# Altium schematic sheet Ripple_PMS.SchDoc
size C; SheetNumber: 1; SheetTotal: 1
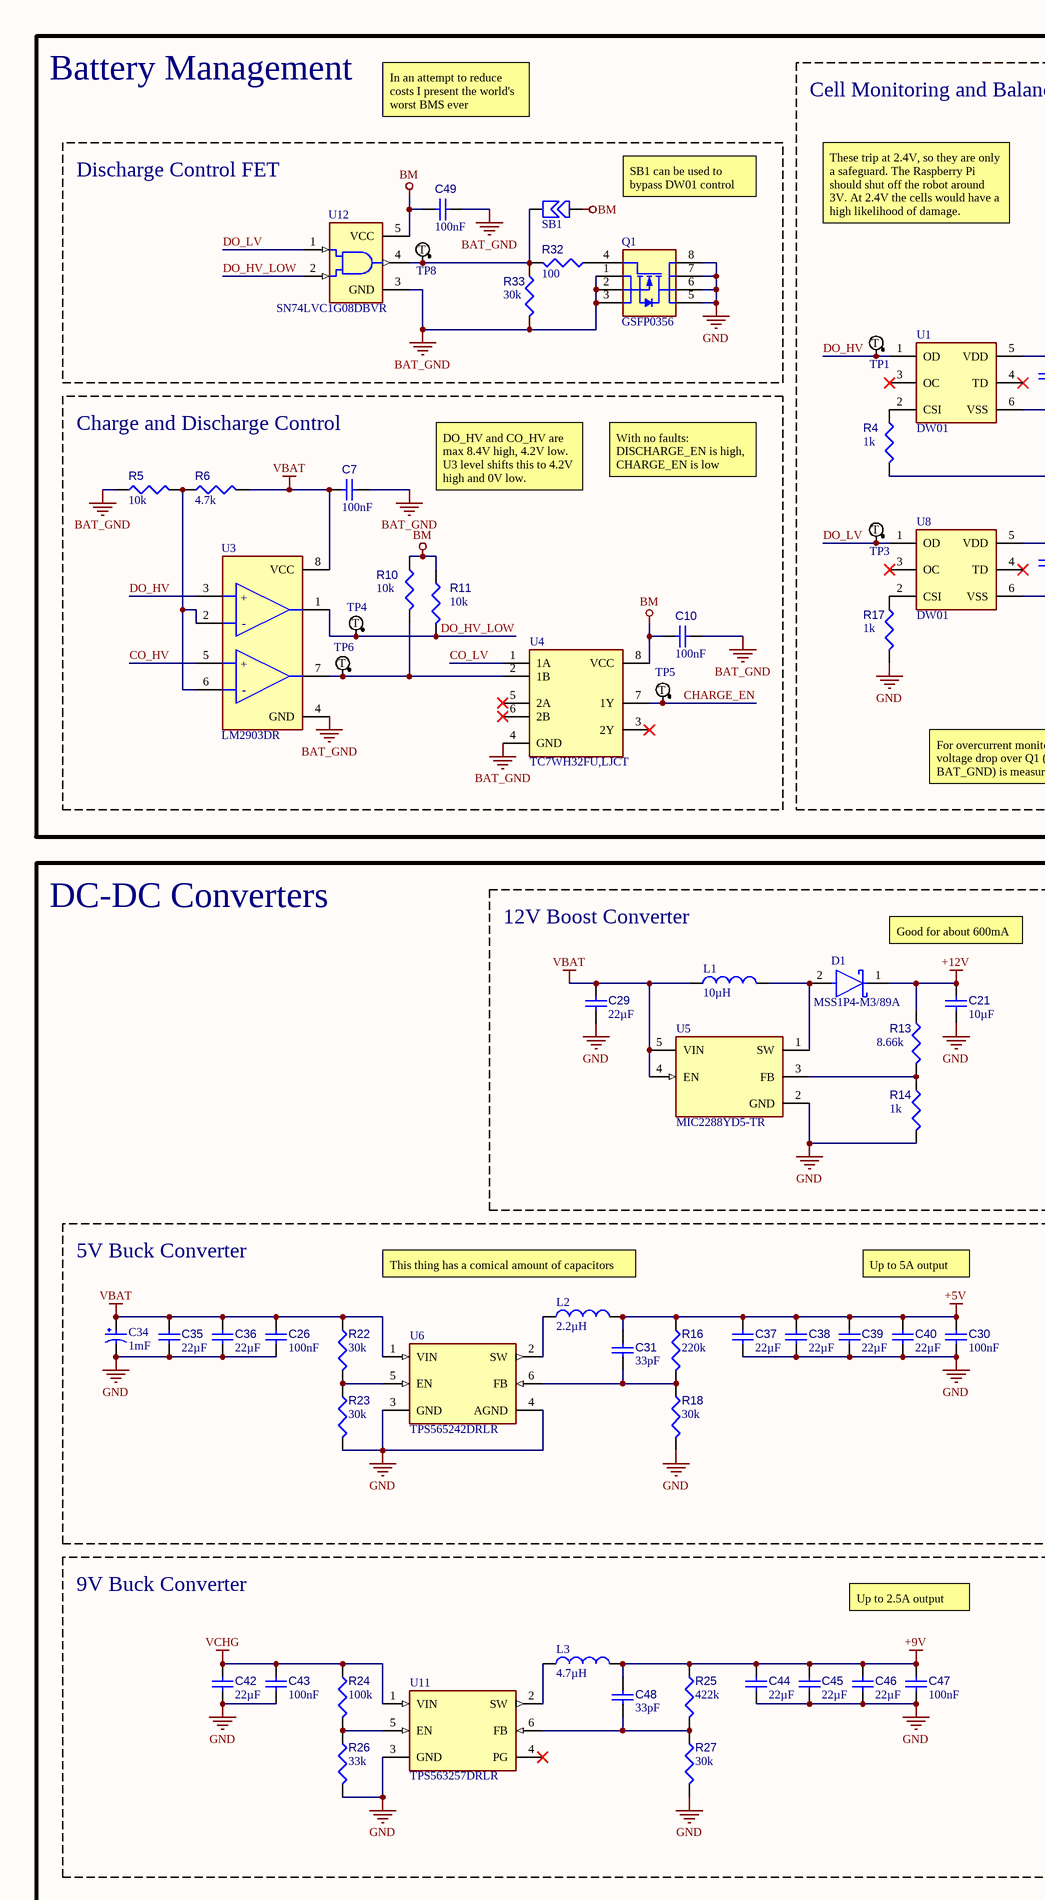
[diagram p0: Ripple_PMS.SchDoc, left]
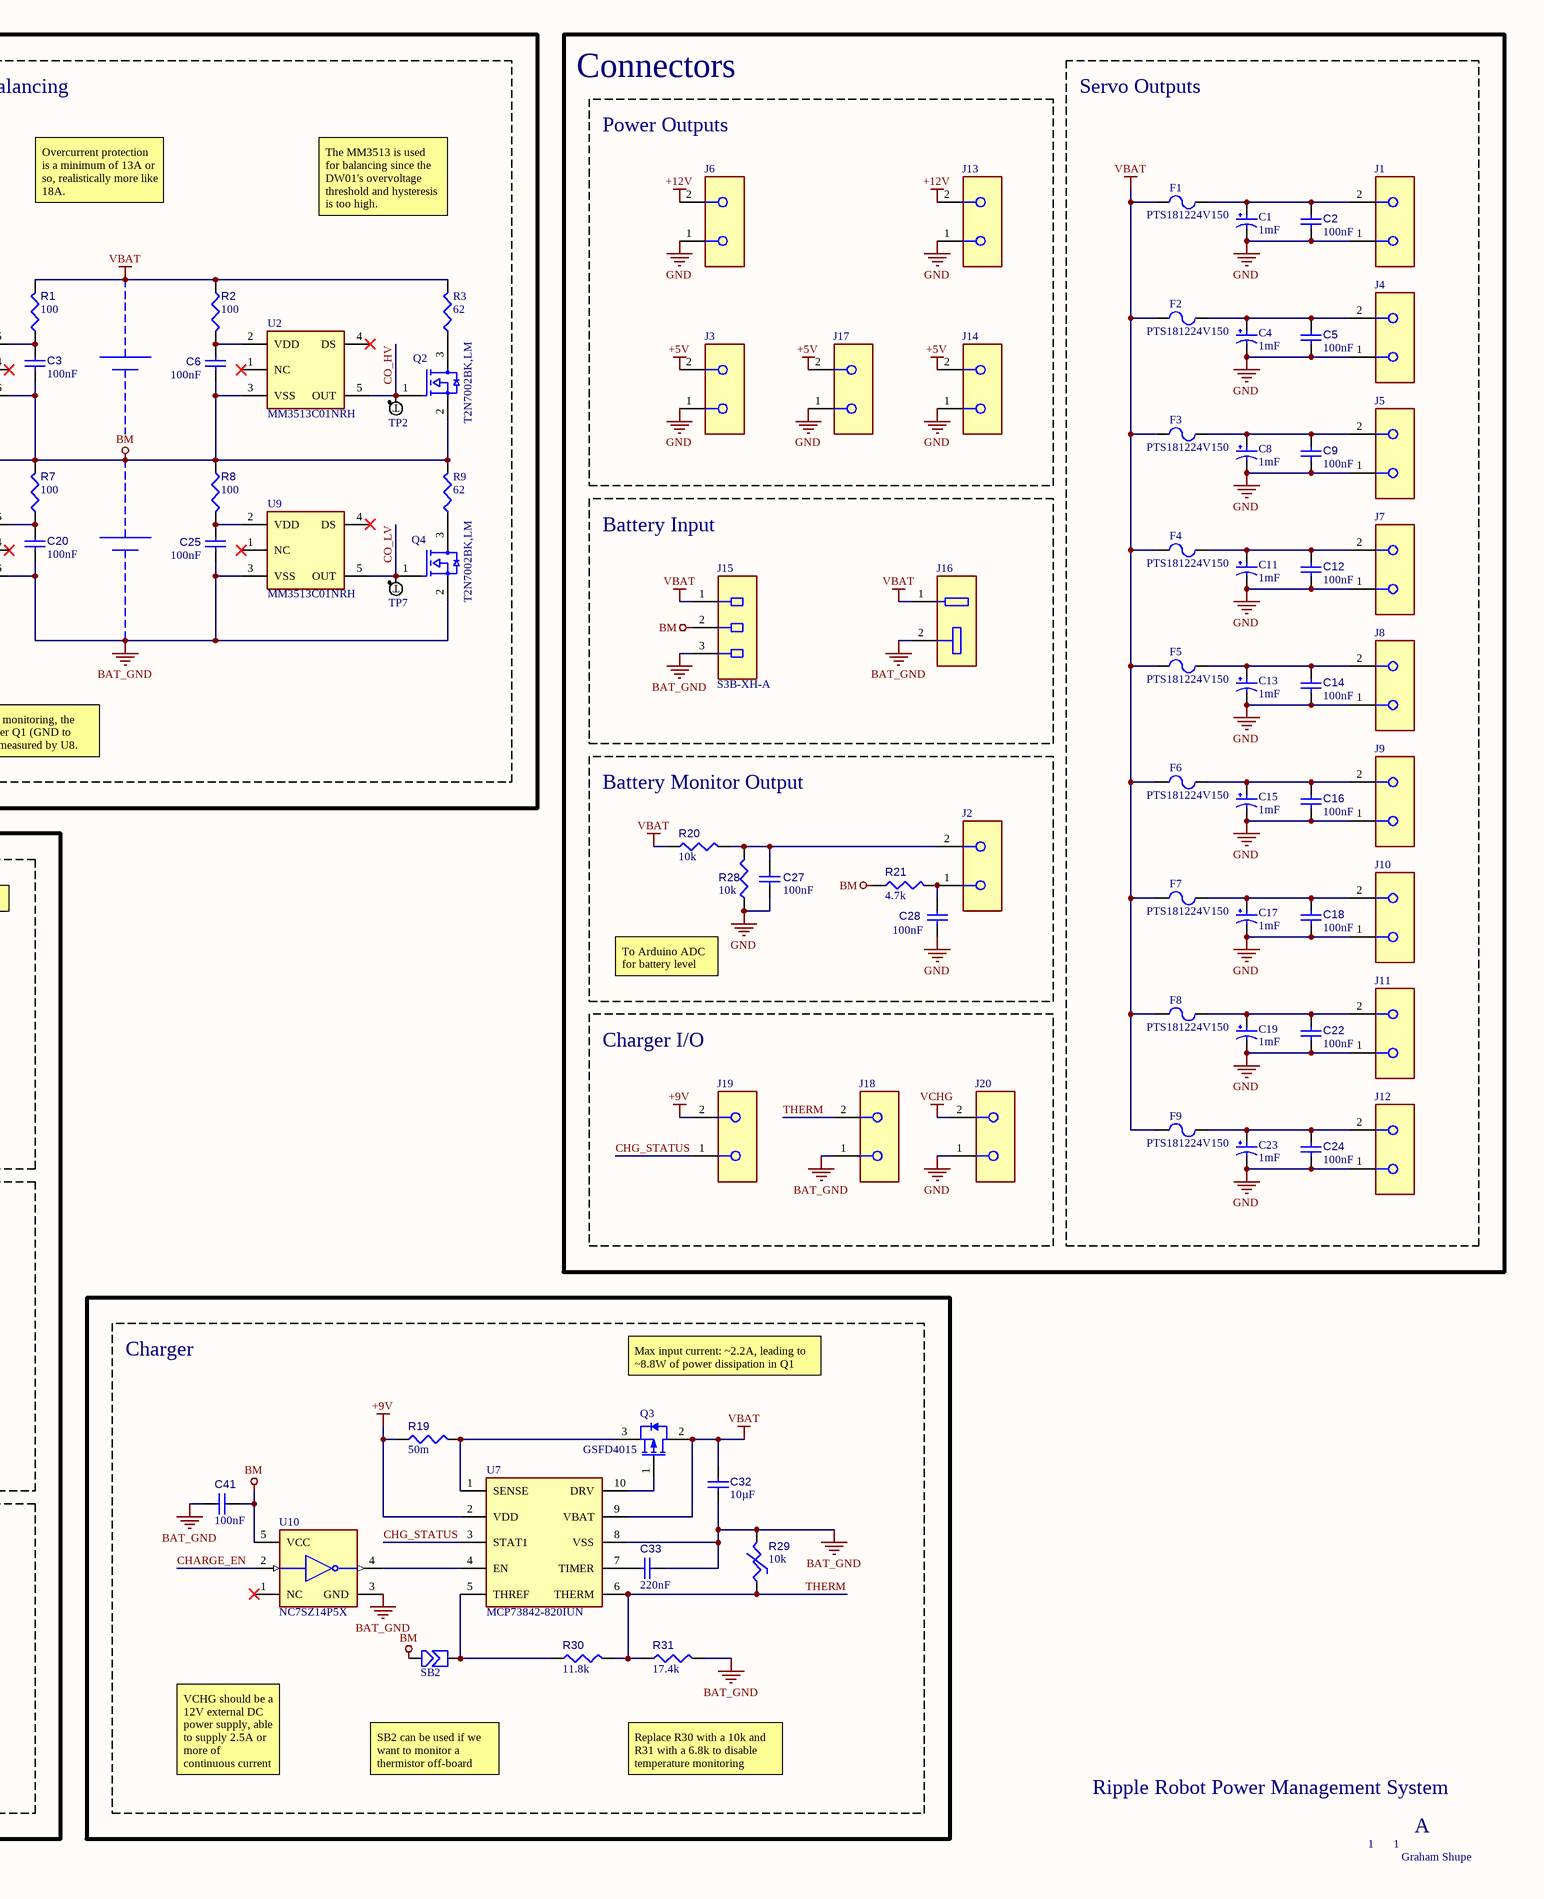
[diagram p1: Ripple_PMS.SchDoc, right]

## Parts
C1  value 1mF  [CAP_YX_10X16_RUB]  (hidden comment: 16ZLH1000MEFC10X16)
C2  value 100nF  [CAPC2013X95X50LL10T25]  (hidden comment: Capacitor 100 nF +/-10% 50 V 0805)
C3  value 100nF  [CAPC2013X95X50LL10T25]  (hidden comment: Capacitor 100 nF +/-10% 50 V 0805)
C4  value 1mF  [CAP_YX_10X16_RUB]  (hidden comment: 16ZLH1000MEFC10X16)
C5  value 100nF  [CAPC2013X95X50LL10T25]  (hidden comment: Capacitor 100 nF +/-10% 50 V 0805)
C6  value 100nF  [CAPC2013X95X50LL10T25]  (hidden comment: Capacitor 100 nF +/-10% 50 V 0805)
C7  value 100nF  [CAPC2013X95X50LL10T25]  (hidden comment: Capacitor 100 nF +/-10% 50 V 0805)
C8  value 1mF  [CAP_YX_10X16_RUB]  (hidden comment: 16ZLH1000MEFC10X16)
C9  value 100nF  [CAPC2013X95X50LL10T25]  (hidden comment: Capacitor 100 nF +/-10% 50 V 0805)
C10  value 100nF  [CAPC2013X95X50LL10T25]  (hidden comment: Capacitor 100 nF +/-10% 50 V 0805)
C11  value 1mF  [CAP_YX_10X16_RUB]  (hidden comment: 16ZLH1000MEFC10X16)
C12  value 100nF  [CAPC2013X95X50LL10T25]  (hidden comment: Capacitor 100 nF +/-10% 50 V 0805)
C13  value 1mF  [CAP_YX_10X16_RUB]  (hidden comment: 16ZLH1000MEFC10X16)
C14  value 100nF  [CAPC2013X95X50LL10T25]  (hidden comment: Capacitor 100 nF +/-10% 50 V 0805)
C15  value 1mF  [CAP_YX_10X16_RUB]  (hidden comment: 16ZLH1000MEFC10X16)
C16  value 100nF  [CAPC2013X95X50LL10T25]  (hidden comment: Capacitor 100 nF +/-10% 50 V 0805)
C17  value 1mF  [CAP_YX_10X16_RUB]  (hidden comment: 16ZLH1000MEFC10X16)
C18  value 100nF  [CAPC2013X95X50LL10T25]  (hidden comment: Capacitor 100 nF +/-10% 50 V 0805)
C19  value 1mF  [CAP_YX_10X16_RUB]  (hidden comment: 16ZLH1000MEFC10X16)
C20  value 100nF  [CAPC2013X95X50LL10T25]  (hidden comment: Capacitor 100 nF +/-10% 50 V 0805)
C21  value 10µF  [CAPC0805(2012)145_L]  (hidden comment: Capacitor 10µF +/-20% 25V 0805)
C22  value 100nF  [CAPC2013X95X50LL10T25]  (hidden comment: Capacitor 100 nF +/-10% 50 V 0805)
C23  value 1mF  [CAP_YX_10X16_RUB]  (hidden comment: 16ZLH1000MEFC10X16)
C24  value 100nF  [CAPC2013X95X50LL10T25]  (hidden comment: Capacitor 100 nF +/-10% 50 V 0805)
C25  value 100nF  [CAPC2013X95X50LL10T25]  (hidden comment: Capacitor 100 nF +/-10% 50 V 0805)
C26  value 100nF  [CAPC2013X95X50LL10T25]  (hidden comment: Capacitor 100 nF +/-10% 50 V 0805)
C27  value 100nF  [CAPC2013X95X50LL10T25]  (hidden comment: Capacitor 100 nF +/-10% 50 V 0805)
C28  value 100nF  [CAPC2013X95X50LL10T25]  (hidden comment: Capacitor 100 nF +/-10% 50 V 0805)
C29  value 22µF  [CAPC0805(2012)145_L]  (hidden comment: Capacitor 22µF +/-40% 16V 0805)
C30  value 100nF  [CAPC2013X95X50LL10T25]  (hidden comment: Capacitor 100 nF +/-10% 50 V 0805)
C31  value 33pF  [RESC2012X06N]  (hidden comment: 33 pF Capacitor)
C32  value 10µF  [CAPC0805(2012)145_L]  (hidden comment: Capacitor 10µF +/-20% 25V 0805)
C33  value 220nF  [RESC2012X06N]  (hidden comment: 220 nF Capacitor)
C34  value 1mF  [CAP_YX_10X16_RUB]  (hidden comment: 16ZLH1000MEFC10X16)
C35  value 22µF  [CAPC0805(2012)145_L]  (hidden comment: Capacitor 22µF +/-40% 16V 0805)
C36  value 22µF  [CAPC0805(2012)145_L]  (hidden comment: Capacitor 22µF +/-40% 16V 0805)
C37  value 22µF  [CAPC0805(2012)145_L]  (hidden comment: Capacitor 22µF +/-40% 16V 0805)
C38  value 22µF  [CAPC0805(2012)145_L]  (hidden comment: Capacitor 22µF +/-40% 16V 0805)
C39  value 22µF  [CAPC0805(2012)145_L]  (hidden comment: Capacitor 22µF +/-40% 16V 0805)
C40  value 22µF  [CAPC0805(2012)145_L]  (hidden comment: Capacitor 22µF +/-40% 16V 0805)
C41  value 100nF  [CAPC2013X95X50LL10T25]  (hidden comment: Capacitor 100 nF +/-10% 50 V 0805)
C42  value 22µF  [CAPC0805(2012)145_L]  (hidden comment: Capacitor 22µF +/-40% 16V 0805)
C43  value 100nF  [CAPC2013X95X50LL10T25]  (hidden comment: Capacitor 100 nF +/-10% 50 V 0805)
C44  value 22µF  [CAPC0805(2012)145_L]  (hidden comment: Capacitor 22µF +/-40% 16V 0805)
C45  value 22µF  [CAPC0805(2012)145_L]  (hidden comment: Capacitor 22µF +/-40% 16V 0805)
C46  value 22µF  [CAPC0805(2012)145_L]  (hidden comment: Capacitor 22µF +/-40% 16V 0805)
C47  value 100nF  [CAPC2013X95X50LL10T25]  (hidden comment: Capacitor 100 nF +/-10% 50 V 0805)
C48  value 33pF  [RESC2012X06N]  (hidden comment: 33 pF Capacitor)
C49  value 100nF  [CAPC2013X95X50LL10T25]  (hidden comment: Capacitor 100 nF +/-10% 50 V 0805)
D1  MSS1P4-M3/89A  [FP-96591-MFG]
F1  PTS181224V150  [FUSE_PTS18126_COB]
F2  PTS181224V150  [FUSE_PTS18126_COB]
F3  PTS181224V150  [FUSE_PTS18126_COB]
F4  PTS181224V150  [FUSE_PTS18126_COB]
F5  PTS181224V150  [FUSE_PTS18126_COB]
F6  PTS181224V150  [FUSE_PTS18126_COB]
F7  PTS181224V150  [FUSE_PTS18126_COB]
F8  PTS181224V150  [FUSE_PTS18126_COB]
F9  PTS181224V150  [FUSE_PTS18126_COB]
J1  ServoBreakout2Pin  [New footprint 1]  (value not drawn)
J2  ServoBreakout2Pin  [New footprint 1]  (value not drawn)
J3  ServoBreakout2Pin  [New footprint 1]  (value not drawn)
J4  ServoBreakout2Pin  [New footprint 1]  (value not drawn)
J5  ServoBreakout2Pin  [New footprint 1]  (value not drawn)
J6  ServoBreakout2Pin  [New footprint 1]  (value not drawn)
J7  ServoBreakout2Pin  [New footprint 1]  (value not drawn)
J8  ServoBreakout2Pin  [New footprint 1]  (value not drawn)
J9  ServoBreakout2Pin  [New footprint 1]  (value not drawn)
J10  ServoBreakout2Pin  [New footprint 1]  (value not drawn)
J11  ServoBreakout2Pin  [New footprint 1]  (value not drawn)
J12  ServoBreakout2Pin  [New footprint 1]  (value not drawn)
J13  ServoBreakout2Pin  [New footprint 1]  (value not drawn)
J14  ServoBreakout2Pin  [New footprint 1]  (value not drawn)
J15  S3B-XH-A  [FP-S3B-XH-A-1_LF_SN-MFG]
J16  Deans Connector  [Deans Connector-Footprint-1]  (value not drawn)  (no BOM)
J17  ServoBreakout2Pin  [New footprint 1]  (value not drawn)
J18  ServoBreakout2Pin  [New footprint 1]  (value not drawn)
J19  ServoBreakout2Pin  [New footprint 1]  (value not drawn)
J20  ServoBreakout2Pin  [New footprint 1]  (value not drawn)
L1  value 10µH  [BOUR-CM322522_V]  (hidden comment: CBC3225T100MR)
L2  value 2.2µH  [IND_SDES064T_CYN]  (hidden comment: SDES064T-2R2MS)
L3  value 4.7µH  [IND_VLS6045EX-4R7M_TDK]  (hidden comment: VLS6045EX-4R7M)
Q1  GSFP0356  [PPAK5X6-8L_GAS]
Q2  T2N7002BK,LM  [SOT23_TOS]
Q3  GSFD4015  [PMOSGDS_TO-252_DPAK_GAS]
Q4  T2N7002BK,LM  [SOT23_TOS]
R1  value 100  [RESC2012X06N]  (hidden comment: 100R resistor)
R2  value 100  [RESC2012X06N]  (hidden comment: 100R resistor)
R3  value 62  [RES_R1632_ROM]  (hidden comment: 62 Ohm Resistor 1206 WIDE)
R4  value 1k  [RESC0805(2012)_L]  (hidden comment: Resistor 1K +/-5% 0805 125 mW)
R5  value 10k  [RESC2013X50X35ML15T15]  (hidden comment: Resistor 10k +/-1% 0805 125 mW)
R6  value 4.7k  [RESC2013X70X40ML20T20]  (hidden comment: Resistor 4k7 +/-1% 0805 125 mW)
R7  value 100  [RESC2012X06N]  (hidden comment: 100R resistor)
R8  value 100  [RESC2012X06N]  (hidden comment: 100R resistor)
R9  value 62  [RES_R1632_ROM]  (hidden comment: 62 Ohm Resistor 1206 WIDE)
R10  value 10k  [RESC2013X50X35ML15T15]  (hidden comment: Resistor 10k +/-1% 0805 125 mW)
R11  value 10k  [RESC2013X50X35ML15T15]  (hidden comment: Resistor 10k +/-1% 0805 125 mW)
R13  value 8.66k  [RESC2012X06N]  (hidden comment: 8.66 kOhm Resistor)
R14  value 1k  [RESC0805(2012)_L]  (hidden comment: Resistor 1K +/-5% 0805 125 mW)
R16  value 220k  [RESC2012X06N]  (hidden comment: 220k Resistor)
R17  value 1k  [RESC0805(2012)_L]  (hidden comment: Resistor 1K +/-5% 0805 125 mW)
R18  value 30k  [RESC2012X06N]  (hidden comment: 30k Resistor)
R19  value 50m  [RESC2014X06N]  (hidden comment: 50 mOhm Sense Resistor)
R20  value 10k  [RESC2013X50X35ML15T15]  (hidden comment: Resistor 10k +/-1% 0805 125 mW)
R21  value 4.7k  [RESC2013X70X40ML20T20]  (hidden comment: Resistor 4k7 +/-1% 0805 125 mW)
R22  value 30k  [RESC2012X06N]  (hidden comment: 30k Resistor)
R23  value 30k  [RESC2012X06N]  (hidden comment: 30k Resistor)
R24  value 100k  [RESC2013X70X40ML20T20]  (hidden comment: Resistor 100k +/-1% 0805 125 mW)
R25  value 422k  [RESC2012X06N]  (hidden comment: 422k Resistor)
R26  value 33k  [RESC2012X06N]  (hidden comment: 33k ohm Resistor)
R27  value 30k  [RESC2012X06N]  (hidden comment: 30k Resistor)
R28  value 10k  [RESC2013X50X35ML15T15]  (hidden comment: Resistor 10k +/-1% 0805 125 mW)
R29  value 10k  [RESC1608X06N]  (hidden comment: NTC Thermistor 10k)
R30  value 11.8k  [RESC2012X06N]  (hidden comment: 11.8k Resistor)
R31  value 17.4k  [RESC2012X06N]  (hidden comment: 17.4k Resistor)
R32  value 100  [RESC2012X06N]  (hidden comment: 100R resistor)
R33  value 30k  [RESC2012X06N]  (hidden comment: 30k Resistor)
SB1  Solder Jumper NO  [RESC1608X06N]  (value not drawn)
SB2  Solder Jumper NO  [RESC1608X06N]  (value not drawn)
TP1  Round Pad Testpoint  [Round Pad Testpoint-Footprint-1]  (value not drawn)  (no BOM)
TP2  Round Pad Testpoint  [Round Pad Testpoint-Footprint-1]  (value not drawn)  (no BOM)
TP3  Round Pad Testpoint  [Round Pad Testpoint-Footprint-1]  (value not drawn)  (no BOM)
TP4  Round Pad Testpoint  [Round Pad Testpoint-Footprint-1]  (value not drawn)  (no BOM)
TP5  Round Pad Testpoint  [Round Pad Testpoint-Footprint-1]  (value not drawn)  (no BOM)
TP6  Round Pad Testpoint  [Round Pad Testpoint-Footprint-1]  (value not drawn)  (no BOM)
TP7  Round Pad Testpoint  [Round Pad Testpoint-Footprint-1]  (value not drawn)  (no BOM)
TP8  Round Pad Testpoint  [Round Pad Testpoint-Footprint-1]  (value not drawn)  (no BOM)
U1  DW01  [SOT95P280X130-6N]
U2  MM3513C01NRH  [SOT95P280X130-5N]
U3  LM2903DR  [FP-D0008A-IPC_B]
U4  TC7WH32FU,LJCT  [SM8_TOS]
U5  MIC2288YD5-TR  [FP-TSOT-5LD-PL-1-IPC_B]
U6  TPS565242DRLR  [SOT6_DRL_TEX]
U7  MCP73842-820IUN  [MSOP10_MC_MCH]
U8  DW01  [SOT95P280X130-6N]
U9  MM3513C01NRH  [SOT95P280X130-5N]
U10  NC7SZ14P5X  [FP-419AC-01-IPC_C]
U11  TPS563257DRLR  [SOT6_DRL_TEX]
U12  SN74LVC1G08DBVR  [DBV0005A_L]

## Blocks framed on the sheet
Cell Monitoring and Balancing: C3 C6 C20 C25 Q2 Q4 R1-R4 R7-R9 R17 TP1-TP3 TP7 U1 U2 U8 U9
Servo Outputs: C1 C2 C4 C5 C8 C9 C11-C19 C22-C24 F1-F9 J1 J4 J5 J7-J12
Power Outputs: J3 J6 J13 J14 J17
Discharge Control FET: C49 Q1 R32 R33 SB1 TP8 U12
Charge and Discharge Control: C7 C10 R5 R6 R10 R11 TP4-TP6 U3 U4
Battery Input: J15 J16
Battery Monitor Output: C27 C28 J2 R20 R21 R28
12V Boost Converter: C21 C29 D1 L1 R13 R14 U5
Charger I/O: J18-J20
5V Buck Converter: C26 C30 C31 C34-C40 L2 R16 R18 R22 R23 U6
Charger: C32 C33 C41 Q3 R19 R29-R31 SB2 U7 U10
9V Buck Converter: C42-C48 L3 R24-R27 U11

## Nets
+5V: C30.1 C31.1 C37.1 C38.1 C39.1 C40.1 J3.2 J14.2 J17.2 L2.2 R16.1
+9V: C44.1 C45.1 C46.1 C47.1 C48.1 J19.2 L3.1 R19.1 R25.1 U7.2(VDD)
+12V: C21.1 D1.1(C) J6.2 J13.2 R13.1
BAT_GND: C7.1 C10.1 C20.2 C25.2 C32.2 C33.2 C41.1 C49.1 J15.3 J16.2 J18.1 Q1.1 Q1.2 Q1.3 Q4.2(S) R5.1 R29.2 R31.2 R33.2 U3.4(GND) U4.4(GND) U7.8(VSS) U8.6(VSS) U9.3(VSS) U10.3(GND) U12.3(GND)
BM: C3.2 C6.2 C10.2 C41.2 C49.2 J15.2 Q2.2(S) R4.2 R7.2 R8.2 R9.1 R10.1 R11.1 R21.1 SB1.1(A) SB2.1(A) U1.6(VSS) U2.3(VSS) U4.8(VCC) U10.5(VCC) U12.5(VCC)
GND: C1.2 C2.2 C4.2 C5.2 C8.2 C9.2 C11.2 C12.2 C13.2 C14.2 C15.2 C16.2 C17.2 C18.2 C19.2 C21.2 C22.2 C23.2 C24.2 C26.2 C27.2 C28.2 C29.2 C30.2 C34.2 C35.2 C36.2 C37.2 C38.2 C39.2 C40.2 C42.2 C43.2 C44.2 C45.2 C46.2 C47.2 J1.1 J3.1 J4.1 J5.1 J6.1 J7.1 J8.1 J9.1 J10.1 J11.1 J12.1 J13.1 J14.1 J17.1 J20.1 Q1.5 Q1.6 Q1.7 Q1.8 R14.2 R17.2 R18.2 R23.2 R26.2 R27.2 R28.1 U5.2(GND) U6.3(GND) U6.4(AGND) U11.3(GND)
VBAT: C7.2 C26.1 C29.1 C32.1 C34.1 C35.1 C36.1 F1.1 F2.1 F3.1 F4.1 F5.1 F6.1 F7.1 F8.1 F9.1 J15.1 J16.1 L1.1 Q3.2(DRAIN) R1.2 R2.2 R3.1 R6.2 R20.1 R22.1 U3.8(VCC) U5.4(EN) U5.5(VIN) U6.1(VIN) U7.9(VBAT)
VCHG: C42.1 C43.1 J20.2 R24.1 U11.1(VIN)
CHARGE_EN: TP5.1 U4.7(1Y) U10.2(A)
CHG_STATUS: J19.1 U7.3(STAT1)
CO_HV: Q2.1(G) TP2.1 U2.5(OUT) U3.5
CO_LV: Q4.1(G) TP7.1 U4.1(1A) U9.5(OUT)
DO_HV: TP1.1 U1.1(OD) U3.3
DO_HV_LOW: R11.2 TP4.1 U3.1 U12.2(B)
DO_LV: TP3.1 U8.1(OD) U12.1(A)
THERM: J18.2 R29.1 R30.2 R31.1 U7.6(THERM)
NetC1_1: C1.1 C2.1 F1.2 J1.2
NetC3_1: C3.1 R1.1 U1.5(VDD)
NetC4_1: C4.1 C5.1 F2.2 J4.2
NetC6_1: C6.1 R2.1 U2.2(VDD)
NetC8_1: C8.1 C9.1 F3.2 J5.2
NetC11_1: C11.1 C12.1 F4.2 J7.2
NetC13_1: C13.1 C14.1 F5.2 J8.2
NetC15_1: C15.1 C16.1 F6.2 J9.2
NetC17_1: C17.1 C18.1 F7.2 J10.2
NetC19_1: C19.1 C22.1 F8.2 J11.2
NetC20_1: C20.1 R7.1 U8.5(VDD)
NetC23_1: C23.1 C24.1 F9.2 J12.2
NetC25_1: C25.1 R8.1 U9.2(VDD)
NetC27_1: C27.1 J2.2 R20.2 R28.2
NetC28_1: C28.1 J2.1 R21.2
NetC31_2: C31.2 R16.2 R18.1 U6.6(FB)
NetC33_1: C33.1 U7.7(TIMER)
NetC48_2: C48.2 R25.2 R27.1 U11.6(FB)
NetD1_2: D1.2(A) L1.2 U5.1(SW)
NetL2_1: L2.1 U6.2(SW)
NetL3_2: L3.2 U11.2(SW)
NetQ1_4: Q1.4 R32.1
NetQ2_3: Q2.3(D) R3.2
NetQ3_1: Q3.1(GATE) U7.10(DRV)
NetQ3_3: Q3.3(SOURCE) R19.2 U7.1(SENSE)
NetQ4_3: Q4.3(D) R9.2
NetR4_1: R4.1 U1.2(CSI)
NetR5_2: R5.2 R6.1 U3.2 U3.6
NetR10_2: R10.2 TP6.1 U3.7 U4.2(1B)
NetR13_2: R13.2 R14.1 U5.3(FB)
NetR17_1: R17.1 U8.2(CSI)
NetR22_2: R22.2 R23.1 U6.5(EN)
NetR24_2: R24.2 R26.1 U11.5(EN)
NetR30_1: R30.1 SB2.2(B) U7.5(THREF)
NetR32_2: R32.2 R33.1 SB1.2(B) TP8.1 U12.4(Y)
NetU7_4: U7.4(EN) U10.4(Y)

Not connected (* = marked no-connect by the designer): U1 3(OC)* 4(TD)*; U2 1(NC)* 4(DS)*; U4 3(2Y)* 5(2A)* 6(2B)*; U8 3(OC)* 4(TD)*; U9 1(NC)* 4(DS)*; U10 1(NC)*; U11 4(PG)*

## Notes on the sheet
- Battery Management
- In an attempt to reduce costs I present the world's worst BMS ever
- Connectors
- SB1 can be used to bypass DW01 control
- These trip at 2.4V, so they are only a safeguard. The Raspberry Pi should shut off the robot around 3V. At 2.4V the cells would have a high likelihood of damage.
- Overcurrent protection is a minimum of 13A or so, realistically more like 18A.
- The MM3513 is used for balancing since the DW01's overvoltage threshold and hysteresis is too high.
- DO_HV and CO_HV are max 8.4V high, 4.2V low. U3 level shifts this to 4.2V high and 0V low.
- With no faults:
  DISCHARGE_EN is high, CHARGE_EN is low
- For overcurrent monitoring, the voltage drop over Q1 (GND to BAT_GND) is measured by U8.
- DC-DC Converters
- Good for about 600mA
- To Arduino ADC for battery level
- (near L2) This thing has a comical amount of capacitors
- Up to 5A output
- Max input current: ~2.2A, leading to ~8.8W of power dissipation in Q1
- Up to 2.5A output
- VCHG should be a 12V external DC power supply, able to supply 2.5A or more of continuous current
- SB2 can be used if we want to monitor a thermistor off-board
- Replace R30 with a 10k and R31 with a 6.8k to disable temperature monitoring
- Ripple Robot Power Management System
- 1
- Graham Shupe
- A
- (in symbol CMP-014-00003-1) +; -
- (in symbol CMP-00030-00004-1) T

## Library data of the parts
C1 C4 C8 C11 C13 C15 C17 C19 C23 C34 = CMP-001-00091-3: Description; Manufacturer_Name: Rubycon; Voltage Rating: 16V; Design Item ID: 16ZLH1000MEFC10X16; Manufacturer_Part_Number: 16ZLH1000MEFC10X16; Copyright: Copyright (C) 2025 Ultra Librarian. All rights reserved.; Source: 16ZLH1000MEFC10X16.SchLib; Component Type: Standard; Pins: 2
C2 C3 C5-C7 C9 C10 C12 C14 C16 C18 C20 C22 C24-C28 C30 C41 C43 C47 C49 = CMP-001-00018-6: Chip Capacitor, 100 nF, +/- 10%, 50 V, 0805 (2012 Metric); Capacitor Type: Ceramic; Voltage Rating: 50V; Pins: 2; Max Operating Temperature: 125°C; Min Operating Temperature: -55°C; Mounting Technology: SM; Case/Package: 0805; RoHS Compliant: True; Tolerance: 10%
C21 C32 = CMP-001-00079-4: Chip Capacitor, 10µF +/-20%, 25V, 0805, Thickness 1.45 mm; Tolerance: 10%; Max Operating Temperature: 85°C; Case/Package: 0805; Voltage Rating: 25V; Min Operating Temperature: -55°C; Mounting Technology: SMT; Pins: 2
C29 C35-C40 C42 C44-C46 = CMP-001-00081-4: Chip Capacitor, 22µF +/-40%, 16V, 0805, Thickness 1.45 mm; Tolerance: 5%; Voltage Rating: 16V; Mounting Technology: SMT; Pins: 2; Max Operating Temperature: 85°C; Case/Package: 0805; Min Operating Temperature: -55°C
C31 C48 = CMP-001-00090-1: 0805 33pF; Case/Package: 0805
C33 = CMP-001-00089-1: 0.22 uF; Capacitor Type: Ceramic; Case/Package: 0805
D1 = CMP-02539-000019-1: DIODE SCHOTTKY 40V 1A MICROSMP; Manufacturer: Vishay; Value: 50pF; Peak Reverse Current: 8.5uA; Max Junction Temp: +150°C; Max Surge Forward Current: 25A; Mouser Description: Schottky Diodes & Rectifiers 1.0 Amp 40 Volt; Category: Diode; Height: 0.73mm; Temperature Range High: +150°C; Temperature Range Low: -55°C; ComponentLink2URL: http://www.vishay.com/docs/89019/mss1p4.pdf; Forward Current: 1A; Device Class L1: Discrete Semiconductors; Lead Free: Yes; Octopart: https://octopart.com/mss1p4-m3%2F89a-vishay-42505723; ComponentLink2Description: Datasheet; Digikey Description: DIODE SCHOTTKY 40V 1A MICROSMP; Footprint Url: http://www.vishay.com/docs/96591/microsmp_do-219ad_fredpt.pdf; Package: 96591; Temperature: -55°C to +150°C; Device Class L2: Diodes; Manufacturer Part Number: MSS1P4-M3/89A; Automotive: No; RoHS: TRUE; Device Class L3: Schottky Diodes; Capacitance: 50pF; Max Repetitive Reverse Voltage: 40V
F1-F9 = CMP-005-00014-3: 1.5A hold 3A trip; Manufacturer_Name: Eaton; Component Type: Standard; Design Item ID: PTS18126V300; Source: PTS18126V300.SchLib; Pins: 2; Copyright: Copyright (C) 2025 Ultra Librarian. All rights reserved.; Manufacturer_Part_Number: PTS18126V300
J1-J14 J17-J20 = CMP-00030-00005-3: for ripple bot; Pins: 2
J15 = CMP-002-00077-3: Header for PCB; pitch 2.50mm; 3-contacts; THT; male; side entry; 250V/3A; Voltage Rating: 250V; Connector Type: Male Pin; Max Operating Temperature: 85°C; Pins: 3; Min Operating Temperature: -25°C; Mounting Technology: Through Hole
J16 = CMP-00030-00006-2: T Plug battery connector through-hole; Pins: 2
L1 = CMP-006-00022-1: Chip Inductor, 10 uH, +/- 20%, -40 to 125 degC, 1210 (3225 Metric), RoHS, Tape and Reel; Manufacturer: Bourns; Inductance Tolerance: 10%; Resistance: 0.17; Core Material: Ferrite; Current Rating: 900mA; Shielding: Unshielded; Self Resonant Frequency: 30MHz; Q Factor: 30; Package Description: 2-Pin Surface Mount Device, Body 3.2 x 2.5 mm; Mounting Technology: SM; RoHS Compliant: True; Case/Package: 1210; Pins: 2; Datasheet URL: http://www.murata.com/~/media/webrenewal/support/library/catalog/products/emc/emifil/c30e.ashx?la=en-gb; Datasheet Version: Aug-14; Min Operating Temperature: -20°C; Package Quantity: 1; Packaging: TapeandReel; Inductance: 10µH; Package Reference: 1210; Max Operating Temperature: 100°C
L2 = CMP-006-00021-2: No Description Available; Manufacturer_Name: Cyntec; Max Current Rating: 6.3A; Current Rating: 6.4A; Source: SDES064T-2R2MS.SchLib; Copyright: Copyright (C) 2026 Ultra Librarian. All rights reserved.; Pins: 2; Component Type: Standard; Design Item ID: SDES064T-2R2MS; Manufacturer_Part_Number: SDES064T-2R2MS
L3 = CMP-006-00023-2: 4.7uH inductor; Manufacturer_Name: TDK; Source: VLS6045EX-4R7M.SchLib; Copyright: Copyright (C) 2025 Ultra Librarian. All rights reserved.; Manufacturer_Part_Number: VLS6045EX-4R7M; Component Type: Standard; Design Item ID: VLS6045EX-4R7M; Pins: 2
Q1 = CMP-072-000000-2: 55A N-ch MOSFET, 47W PD@Tc=25; Manufacturer_Name: Good-Ark; Copyright: Copyright (C) 2025 Ultra Librarian. All rights reserved.; Component Type: Standard; RefDes: RefDes; Design Item ID: GSFP1080; Manufacturer_Part_Number: GSFP1080; Pin Count: 8; Type: Type; Source: GSFP1080.SchLib
Q2 Q4 = CMP-054-000000-2: N-ch MOSFET, 60 V, 0.4 A, SOT-23(SOT23); Manufacturer_Name: Toshiba Electronic Devices & Storage Corp.; Type: Type; Manufacturer_Part_Number: T2N7002BK,LM; RefDes: RefDes; Pin Count: 3; Design Item ID: T2N7002BK,LM; Component Type: Standard; Source: T2N7002BK,LM.SchLib; Copyright: Copyright (C) 2026 Ultra Librarian. All rights reserved.
Q3 = CMP-060-000000-2: 40A P-channel MOSFET, 80W PD@Tc25; Manufacturer_Name: Good-Ark; Type: Transistors; Component Type: Standard; Source: GSFD6959.SchLib; Pin Count: 3; Copyright: Copyright (C) 2025 Ultra Librarian. All rights reserved.; Design Item ID: GSFD6959; Manufacturer_Part_Number: GSFD6959
R1 R2 R7 R8 R32 = CMP-009-00199-1: 0805; Case/Package: 0805
R3 R9 = CMP-009-00191-4: 1.5 W; Manufacturer_Name: ROHM Semiconductor; Power: 1.5W; Voltage Rating: 150V; Component Type: Standard; Copyright: Copyright (C) 2026 Ultra Librarian. All rights reserved.; Design Item ID: LTR18EZPJ620; Manufacturer_Part_Number: LTR18EZPJ620; Source: LTR18EZPJ620.SchLib; Case/Package: 1206 WIDE; Pins: 2
R4 R14 R17 = CMP-009-00118-3: Chip Resistor, 1 kOhms, +/-5%, 125 mW, -55 to 155 degC, 0805; Tolerance: 5%; Power: 125mW; Case/Package: 0805; Pins: 2; Min Operating Temperature: -55°C; Max Operating Temperature: 155°C
R5 R10 R11 R20 R28 = CMP-009-00018-5: Chip Resistor, 10 KOhm, +/- 1%, 125 mW, -55 to 155 degC, 0805 (2012 Metric); Power: 125mW; Voltage Rating: 150V; Tolerance: 1%; Pins: 2; Min Operating Temperature: -55°C; Case/Package: 0805; Max Operating Temperature: 155°C; RoHS Compliant: True; Mounting Technology: SM
R6 R21 = CMP-009-00032-5: Chip Resistor, 4.7 KOhm, +/- 1%, 0.125 W, -55 to 155 degC, 0805 (2012 Metric); Power: 125mW; Voltage Rating: 150V; Max Operating Temperature: 155°C; Min Operating Temperature: -55°C; Case/Package: 0805; RoHS Compliant: True; Pins: 2; Tolerance: 1%; Mounting Technology: SM
R13 = CMP-009-00194-1: 0805; Case/Package: 0805
R16 = CMP-009-00196-1: 0805; Case/Package: 0805
R18 R22 R23 R27 R33 = CMP-009-00197-1: 0805; Case/Package: 0805
R19 = CMP-009-00193-1: 3/4W 0.05R; Power: 750mW; Case/Package: 0805
R24 = CMP-009-00024-5: Chip Resistor, 100 KOhm, +/- 1%, 0.125 W, -55 to 155 degC, 0805 (2012 Metric); Power: 125mW; Voltage Rating: 150V; Max Operating Temperature: 155°C; Mounting Technology: SM; RoHS Compliant: True; Tolerance: 1%; Case/Package: 0805; Min Operating Temperature: -55°C; Pins: 2
R25 = CMP-009-00198-1: 0805; Case/Package: 0805
R26 = CMP-009-00195-1: 0805; Power: 125mW; Case/Package: 0805
R29 = CMP-009-00202-1: 0603 10k@25C thermistor; Pins: 2; Case/Package: 0603
R30 = CMP-009-00201-1: 0805; Case/Package: 0805
R31 = CMP-009-00200-1: 0805; Case/Package: 0805
SB1 SB2 = CMP-00030-00003-5: Normally Open; Pins: 2
TP1-TP8 = CMP-00030-00004-1: 2mm pad with no through hole
U1 U8 = CMP-031-00014-2: Battery protection IC, 4.25V overvoltage, 2.4V undervoltage; Pins: 6; Case/Package: SOT23-6
U2 U9 = CMP-031-00012-2: Cell overvoltage monitor, 4.2V trip; Case/Package: SOT-25A; Pins: 5
U3 = CMP-014-00003-1: IC COMPARATOR 2 DIFF 8SOIC "Comparator General Purpose Open-Collector, Rail-to-Rail 8-SOIC"; Output Type: TTL; Min Supply Voltage: 2V; Max Supply Voltage: 30V; Max Operating Temperature: 125°C; Mounting Technology: Surface Mount; Case/Package: SOIC; Pins: 8; Min Operating Temperature: -40°C
U4 = CMP-056-000000-3: 2-CH OR Gate; Manufacturer_Name: Toshiba Electronic Devices & Storage Corp.; Manufacturer_Part_Number: TC7WH32FU,LJ(CT; Copyright: Copyright (C) 2025 Ultra Librarian. All rights reserved.; Design Item ID: TC7WH32FU,LJCT; Pin Count: 8; RefDes: RefDes; Type: Logic; Component Type: Standard; Source: TC7WH32FU,LJCT.SchLib
U5 = CMP-019-00049-1: DC-DC Switching Regulator, Boost, 2.5V to 10V in, 3.6V to 34V out, 1A out, SOT-23-5; Nominal Supply Current: 2.8mA; Frequency: 1.2MHz; Max Supply Voltage: 10V; Output Current: 1A; Min Supply Voltage: 2.5V; Mounting Technology: Surface Mount; Pins: 5; Max Operating Temperature: 125°C; Output Voltage: 34V; Min Operating Temperature: -40°C; Case/Package: TSOT
U6 = CMP-064-000000-2: 3-V to 16-V input voltage, 5-A ECO mode, synchronous buck converter in SOT-563 package 6-SOT-5X3 -40 to 125; Manufacturer_Name: Texas Instruments; Type: Type; Manufacturer_Part_Number: TPS565242DRLR; RefDes: RefDes; Pin Count: 6; Copyright: Copyright (C) 2026 Ultra Librarian. All rights reserved.; Component Type: Standard; Source: TPS565242DRLR.SchLib; Design Item ID: TPS565242DRLR
U7 = CMP-058-000000-2: 8.2V 2 cell battery charger; Manufacturer_Part_Number: MCP73842-820I/UN; Manufacturer_Name: Microchip; RefDes: RefDes; Pin Count: 10; Component Type: Standard; Copyright: Copyright (C) 2025 Ultra Librarian. All rights reserved.; Source: MCP73842-820IUN.SchLib; Type: Type; Design Item ID: MCP73842-820IUN
U10 = CMP-2000-06818-2: IC INVERTER SCHMITT 1CH SC70-5; Manufacturer: ON Semiconductor; Max Supply Voltage: 5.5V; Number Of Circuits: 1; Quiescent Current: 1uA; Standoff Height: 0mm; Max Junction Temp: +150°C; Propagation Delay: 3.7ns; Min Supply Voltage: 1.5V; Logic Function Desc: Inverting; Manufacturer Part Number: NC7SZ14P5X; Package: 419AC-01; Ipc Land Pattern Name: SOT65P210X95-5; Device Class L3: Logic Gates; ComponentLink2URL: https://www.onsemi.com/pub/Collateral/NC7SZ14-D.PDF; Mouser Description: Inverters UHS Inverter; Lead Free: Yes; Device Class L1: Integrated Circuits (ICs); Category: IC; Octopart: https://octopart.com/nc7sz14p5x-on+semiconductor-84330759; Number Of Outputs: 1; Ambient Temperature Range High: +85°C; Temperature Range Low: -40°C; Number Of Inputs: 1; Automotive: No; Height: 1.1mm; Digikey Description: IC INVERTER SCHMITT 1CH SC70-5; Footprint Url: https://www.onsemi.com/pub/Collateral/419AC.PDF; Device Class L2: Logic ICs; ComponentLink2Description: Datasheet; Temperature: -40°C to +85°C; Temperature Range High: +85°C; RoHS: TRUE; Ambient Temperature Range Low: -40°C
U11 = CMP-064-000001-2: 3-V to 17-V input voltage, 0.6-V to 10-V output, 3-A ECO mode, synchronous buck converter in SOT-563 package 6-SOT-5X3 -40 to 125; Manufacturer_Name: Texas Instruments; Pin Count: 6; Copyright: Copyright (C) 2026 Ultra Librarian. All rights reserved.; Manufacturer_Part_Number: TPS563257DRLR; Source: TPS565242DRLR.SchLib; RefDes: RefDes; Component Type: Standard; Design Item ID: TPS565242DRLR; Type: Type
U12 = CMP-016-00010-1: AND Gate, LVC/LCX/Z Series, 1-Func, 2-Input, CMOS, PDSO5; Nominal Supply Voltage: 3.3V; Max Supply Voltage: 5.5V; Min Supply Voltage: 1.65V; RoHS Compliant: Yes; Logic Type: AND GATE; Case/Package: LSSOP; Max Operating Temperature: 125°C; Min Operating Temperature: -40°C; Pins: 5